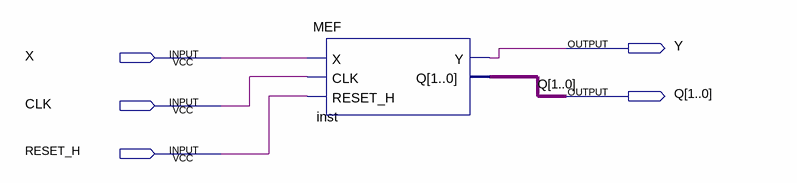
[diagram p0: schematic sheet]
// Quartus schematic MEFDemo.bdf as structural Verilog: 1 symbols, 5 pins
module MEFDemo (
  input  X,
  input  CLK,
  input  RESET_H,
  output Y,
  output [1:0] Q
);

  MEF inst (.X(X), .CLK(CLK), .RESET_H(RESET_H), .Y(Y), .Q(Q));
endmodule
